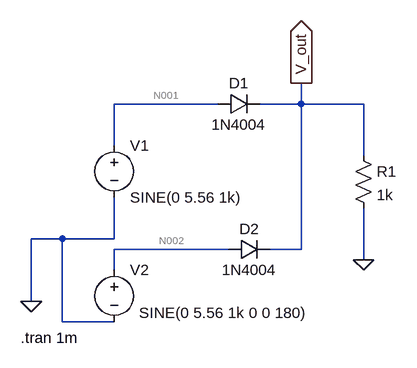
[diagram p0: schematic CircuitoRectificador.asc]
CircuitoRectificador.asc, the LTspice schematic file:
Version 4.1
SHEET 1 880 680
WIRE 224 32 64 32
WIRE 352 32 352 0
WIRE 352 32 288 32
WIRE 448 32 352 32
WIRE 64 96 64 32
WIRE 448 112 448 32
WIRE -16 240 -64 240
WIRE 64 240 64 176
WIRE 64 240 -16 240
WIRE 240 256 64 256
WIRE 352 256 352 32
WIRE 352 256 304 256
WIRE 448 272 448 192
WIRE 64 288 64 256
WIRE -64 336 -64 240
WIRE -16 368 -16 240
WIRE 64 368 -16 368
FLAG 352 0 V_out
IOPIN 352 0 Out
FLAG -64 336 0
FLAG 448 272 0
SYMBOL voltage 64 80 R0
WINDOW 123 0 0 Left 0
WINDOW 39 0 0 Left 0
SYMATTR InstName V1
SYMATTR Value SINE(0 5.56 1k)
SYMBOL voltage 64 272 R0
WINDOW 123 0 0 Left 0
WINDOW 39 0 0 Left 0
WINDOW 3 38 82 Left 2
SYMATTR InstName V2
SYMATTR Value SINE(0 5.56 1k 0 0 180)
SYMBOL diode 224 48 R270
WINDOW 0 32 32 VTop 2
WINDOW 3 0 32 VBottom 2
SYMATTR InstName D1
SYMATTR Value 1N4004
SYMBOL diode 240 272 R270
WINDOW 0 32 32 VTop 2
WINDOW 3 0 32 VBottom 2
SYMATTR InstName D2
SYMATTR Value 1N4004
SYMBOL res 432 96 R0
SYMATTR InstName R1
SYMATTR Value 1k
TEXT -80 392 Left 2 !.tran 1m

The netlist it stands for:
* CircuitoRectificador.asc
V1 N001 0 SINE(0 5.56 1k)
V2 N002 0 SINE(0 5.56 1k 0 0 180)
D1 N001 V_out 1N4004
D2 N002 V_out 1N4004
R1 V_out 0 1k
.model D D
.lib standard.dio
.tran 1m
.backanno
.end

* Results of the author's LTspice run, read from the files saved beside the schematic
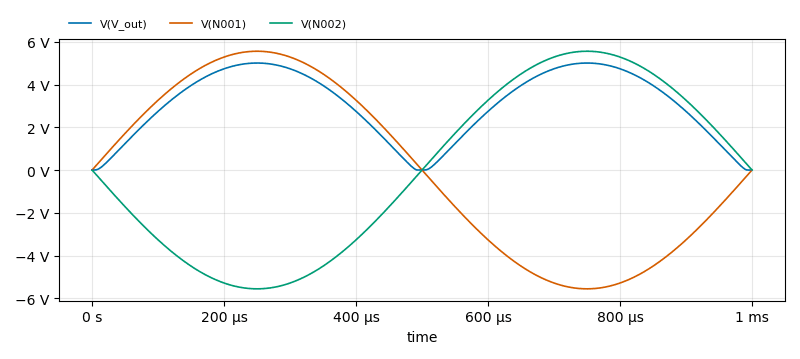
[diagram p1: Transient Analysis of CircuitoRectificador.asc, plotted from the saved traces]
* Transient Analysis, 1 run:
*   V(V_out): min -306.5 µV, max 5.008 V, average 3.038 V, rms 3.456 V, last -13.49 µV
*   V(N001): min -5.56 V, max 5.56 V, average 0 V, rms 3.932 V, last 0 V
*   V(N002): min -5.56 V, max 5.56 V, average 0 V, rms 3.932 V, last 0 V